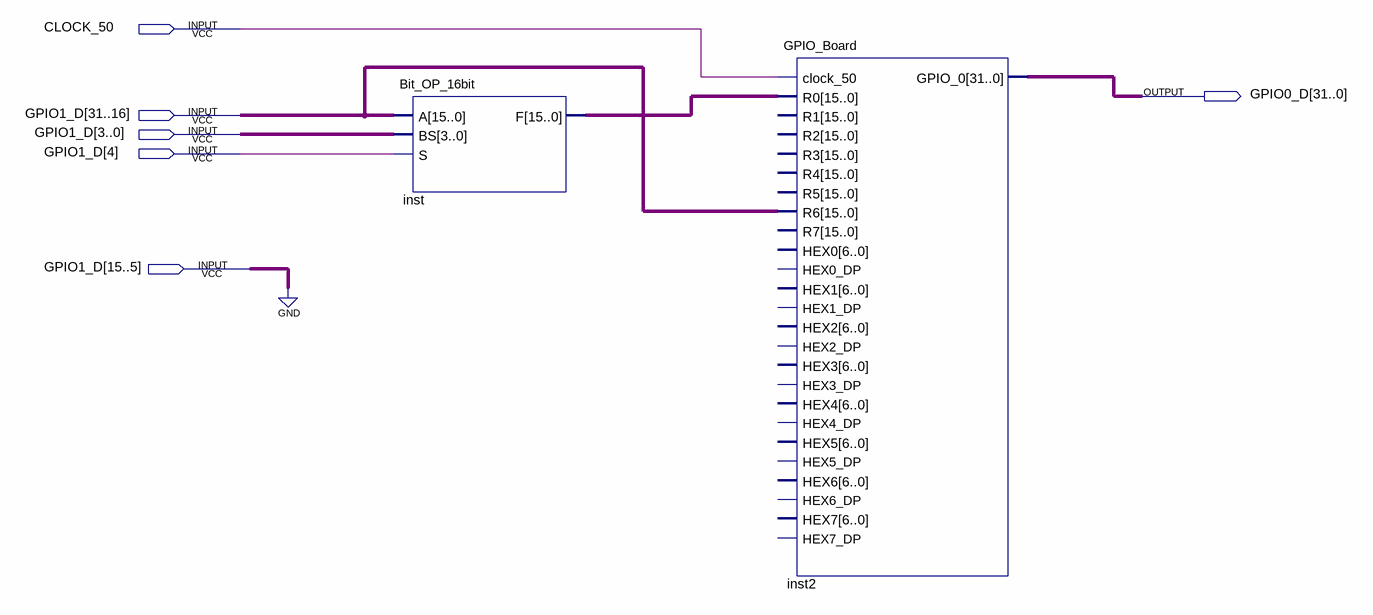
[diagram p0: schematic sheet]
// Quartus schematic SFU_Test.bdf as structural Verilog: 2 symbols, 6 pins
module SFU_Test (
  input  CLOCK_50,
  input  [31:0] GPIO1_D,
  output [31:0] GPIO0_D
);

  wire [15:0] inst_f;

  Bit_OP_16bit inst (.A(GPIO1_D[31:16]), .BS(GPIO1_D[3:0]), .S(GPIO1_D[4]), .F(inst_f));
  GPIO_Board inst2 (
    .clock_50(CLOCK_50), .R0(inst_f), .R6(GPIO1_D[31:16]), .GPIO_0(GPIO0_D));  // open: R1, R2, R3, R4, R5, R7, HEX0, HEX0_DP, HEX1, HEX1_DP, HEX2, HEX2_DP, HEX3, HEX3_DP, HEX4, HEX4_DP, HEX5, HEX5_DP, HEX6, HEX6_DP, HEX7, HEX7_DP
  // also tied to GND on the sheet: {GPIO1_D[5], GPIO1_D[6], GPIO1_D[7], GPIO1_D[8], GPIO1_D[9], GPIO1_D[10], GPIO1_D[11], GPIO1_D[12], GPIO1_D[13], GPIO1_D[14], GPIO1_D[15]}
endmodule
